# EAGLE design avr-micro-usb (EAGLE 6.1)
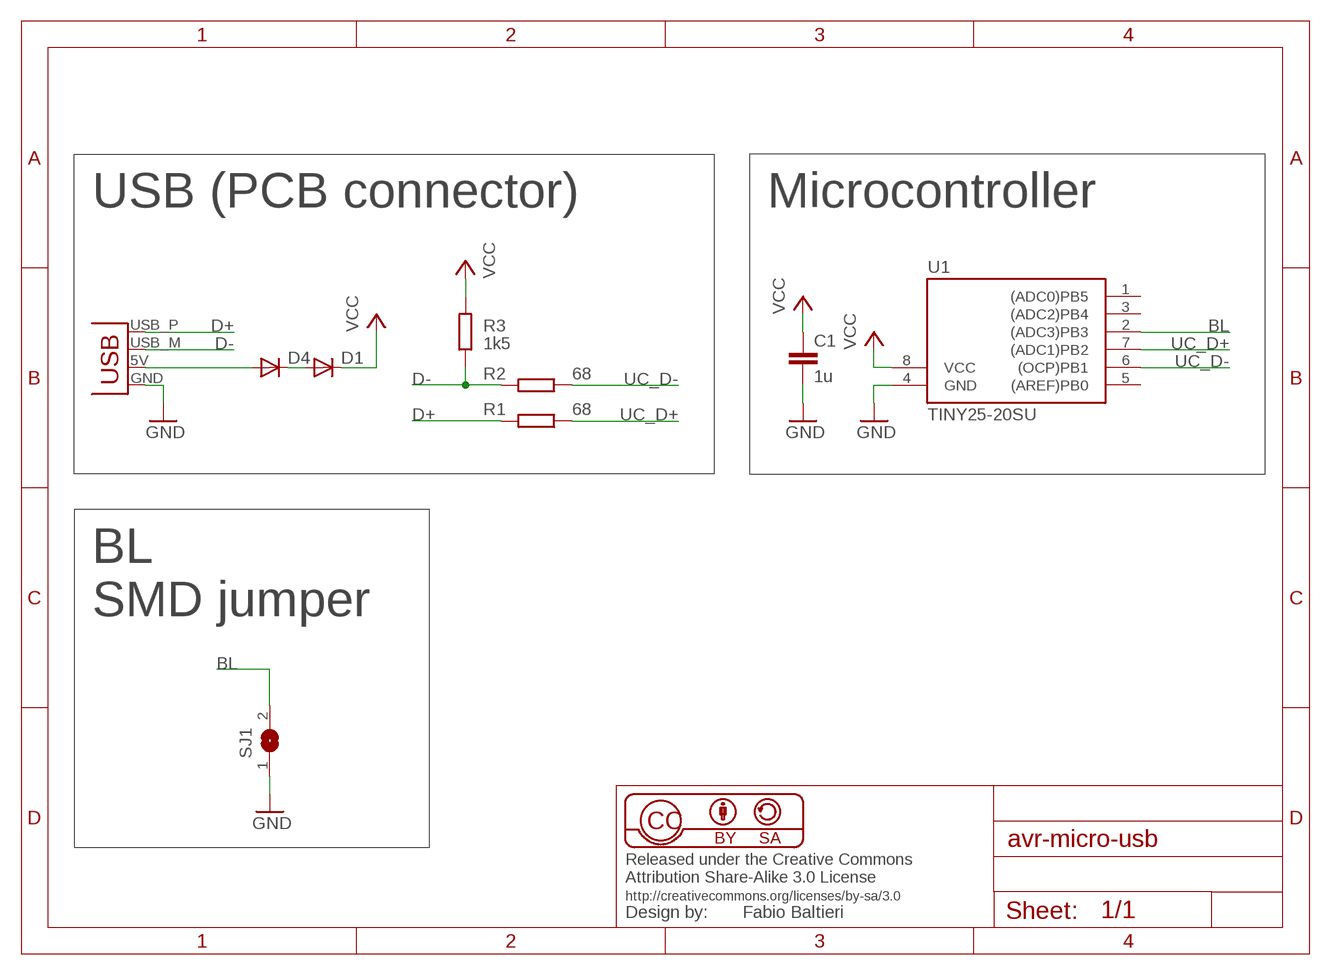
[diagram p0: schematic, sheet 1]

## Parts
C1  1u  C-EUC0805  [C0805]
D1  DIODE-MINIMELF  [MINIMELF]
D4  DIODE-MINIMELF  [MINIMELF]
R1  68  R-EU_R0603  [R0603]
R2  68  R-EU_R0603  [R0603]
R3  1k5  R-EU_R0603  [R0603]
SJ1  SJ  [SJ]
U1  TINY25-20SU  [SOIC8]
X1  USBPCB  [USB-A-PCB]

## Nets
BL: SJ1.2 U1.2((ADC3)PB3)
D+: R1.2 X1.USB_P(D+)
D-: R2.2 R3.1 X1.USB_M(D-)
GND: C1.2 SJ1.1 U1.4(GND) X1.GND
N$1: D4.A X1.5V(VBUS)
N$2: D1.A D4.C
UC_D+: R1.1 U1.7((ADC1)PB2)
UC_D-: R2.1 U1.6((OCP)PB1)
VCC: C1.1 D1.C R3.2 U1.8(VCC)
Unconnected: U1.1((ADC0)PB5) U1.3((ADC2)PB4) U1.5((AREF)PB0)

## Notes on the sheet
- USB (PCB connector) | Microcontroller
- BL
- SMD jumper

## Library data of the parts
C1 = rcl:C-EU: CAPACITOR, European symbol
D1 D4 = diode:DIODE-: DIODE
R1-R3 = rcl:R-EU_: RESISTOR, European symbol
SJ1 = jumper:SJ: SMD solder JUMPER
U1 = avr-5:TINY25
X1 = sparkfun:USB: USB Connectors USB-B-PTH is fully proven SKU : PRT-00139 USB-miniB is fully proven SKU : PRT-00587 USB-A-PCB is untested. USB-A-H is throughly reviewed, but untested. Spark Fun Electronics SKU : PRT-00437 USB-B-SMT is throughly reviewed, but untested. Needs silkscreen touching up. USB-A-S has not been used/tested USB-MB-H has not been used/tested

## Board
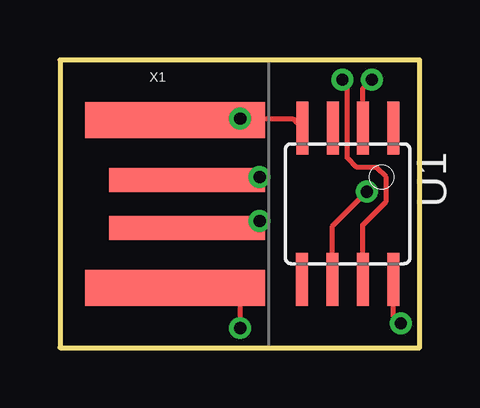
[diagram p1: board, top side]
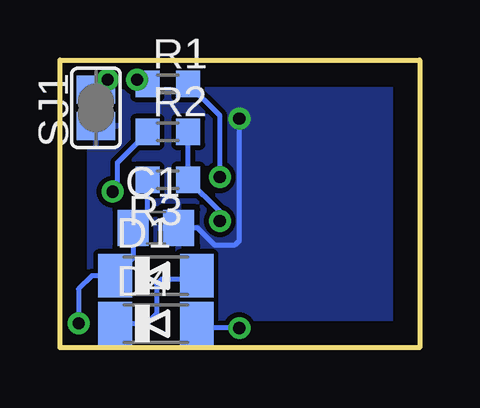
[diagram p2: board, bottom side, seen from below]

Size 15 x 12 mm. Coordinates in mm from the lower left corner, seen from the top.
Outline: 0,0 15,0 15,12 0,12 0,0
Copper layers (1*16): Top 0.035mm / dielectric 1.5mm / Bottom 0.035mm
Design rules: minimum track width 10mil, minimum drill 24mil, track to track 8mil, track to pad 8mil, pad to pad 8mil, via to via 8mil, smd to smd 8mil, copper to edge 40mil, drill to drill 8mil, minimum pad ring 10mil, minimum via ring 8mil, stop-mask expansion 4mil, vias tented up to drill 0mil, thermal gap 10mil

### Footprints (pad centres in the part's own frame; a part is rotated, then mirrored left to right if it is on the bottom)
C0805 = smd 1.3 x 1.5: 1 -0.95,0; 2 0.95,0
MINIMELF = smd 1.4 x 1.8: A 1.7,0; C -1.7,0
R0603 = smd 1 x 1.1: 1 -0.85,0; 2 0.85,0
SJ = smd 1.168 x 1.6: 1 -0.762,0; 2 0.762,0
SOIC8 = smd 0.5 x 2.2: 1 -1.905,-3.154; 2 -0.645,-3.154; 3 0.625,-3.154; 4 1.895,-3.154; 5 1.905,3.154; 6 0.635,3.154; 7 -0.635,3.154; 8 -1.905,3.154
USB-A-PCB = smd 7.5 x 1.5: 5V -0.2,-3.5; GND -0.2,3.5 | smd 6.5 x 1: USB_M 0.3,-1; USB_P 0.3,1

### Placement (x,y rotation side)
C1  11,5 0 bottom
D1  11,3 0 bottom
D4  11,1 0 bottom
R1  10.5,11 0 bottom
R2  10.5,9 0 bottom
R3  10.5,7 180 bottom
SJ1  13.5,10 90 bottom
U1  12,6 180 top
X1  5,6 0 top

### Tracks (layer width: path | path; a pad name or v marks a point on that pad's centre or on a via)
BL  (via drill 0.51)
  Top 0.203: U1.2 12.64,10.82 v13.01,11.18
  Bottom 0.203: v13.01,11.18 13.09,11.18 SJ1.2
D+  (via drill 0.51)
  Top 0.203: X1.USB_P 8.22,7 v8.33,7.11
  Bottom 0.203: v8.33,7.11 8.33,9.68 R1.2
D-  (via drill 0.51)
  Top 0.203: X1.USB_M 8.05,5 v8.33,5.28
  Bottom 0.203: v8.33,5.28 8.33,5.68 R3.1 R2.2
GND  (via drill 0.51)
  Top 0.203: U1.4 9.71,9.55 v7.52,9.55 4.85,9.55 X1.GND
  Bottom 0.203: C1.2 9.27,5 8.53,4.27 7.72,4.27 7.52,4.47 v7.52,9.55
  pour Bottom: 0,12 15,12 15,0 0,0
N$1  (via drill 0.51)
  Top 0.203: X1.5V 7.25,2.5 7.52,2.23 v7.52,0.81
  Bottom 0.203: v7.52,0.81 9.11,0.81 D4.A
N$2
  Bottom 0.203: D4.C 11.39,1 10.97,1.42 10.97,2.64 10.77,2.85 9.46,2.85 D1.A
UC_D+  (via drill 0.51)
  Top 0.203: v11.79,11.18 11.99,10.97 11.99,8.13 11.99,7.92 12.39,7.52 13.21,7.52 13.61,7.11 13.61,6.1 12.8,5.28 12.63,5.12 U1.7
  Bottom 0.203: R1.1 11.61,11 v11.79,11.18
UC_D-  (via drill 0.51)
  Top 0.203: v12.8,6.5 11.58,5.28 11.37,5.07 U1.6
  Bottom 0.203: R2.1 11.35,8.97 12.6,7.72 12.6,6.71 v12.8,6.5
VCC  (via drill 0.51)
  Top 0.203: 14.02,1.22 v14.22,1.02 13.9,1.33 U1.8
  Bottom 0.203: v14.22,1.02 14.22,2.44 13.66,3 D1.C 11.95,3.75 C1.1 11.35,5.6 R3.2